# EAGLE design indor (EAGLE 9.5.2)

## Sheet 1 of 2
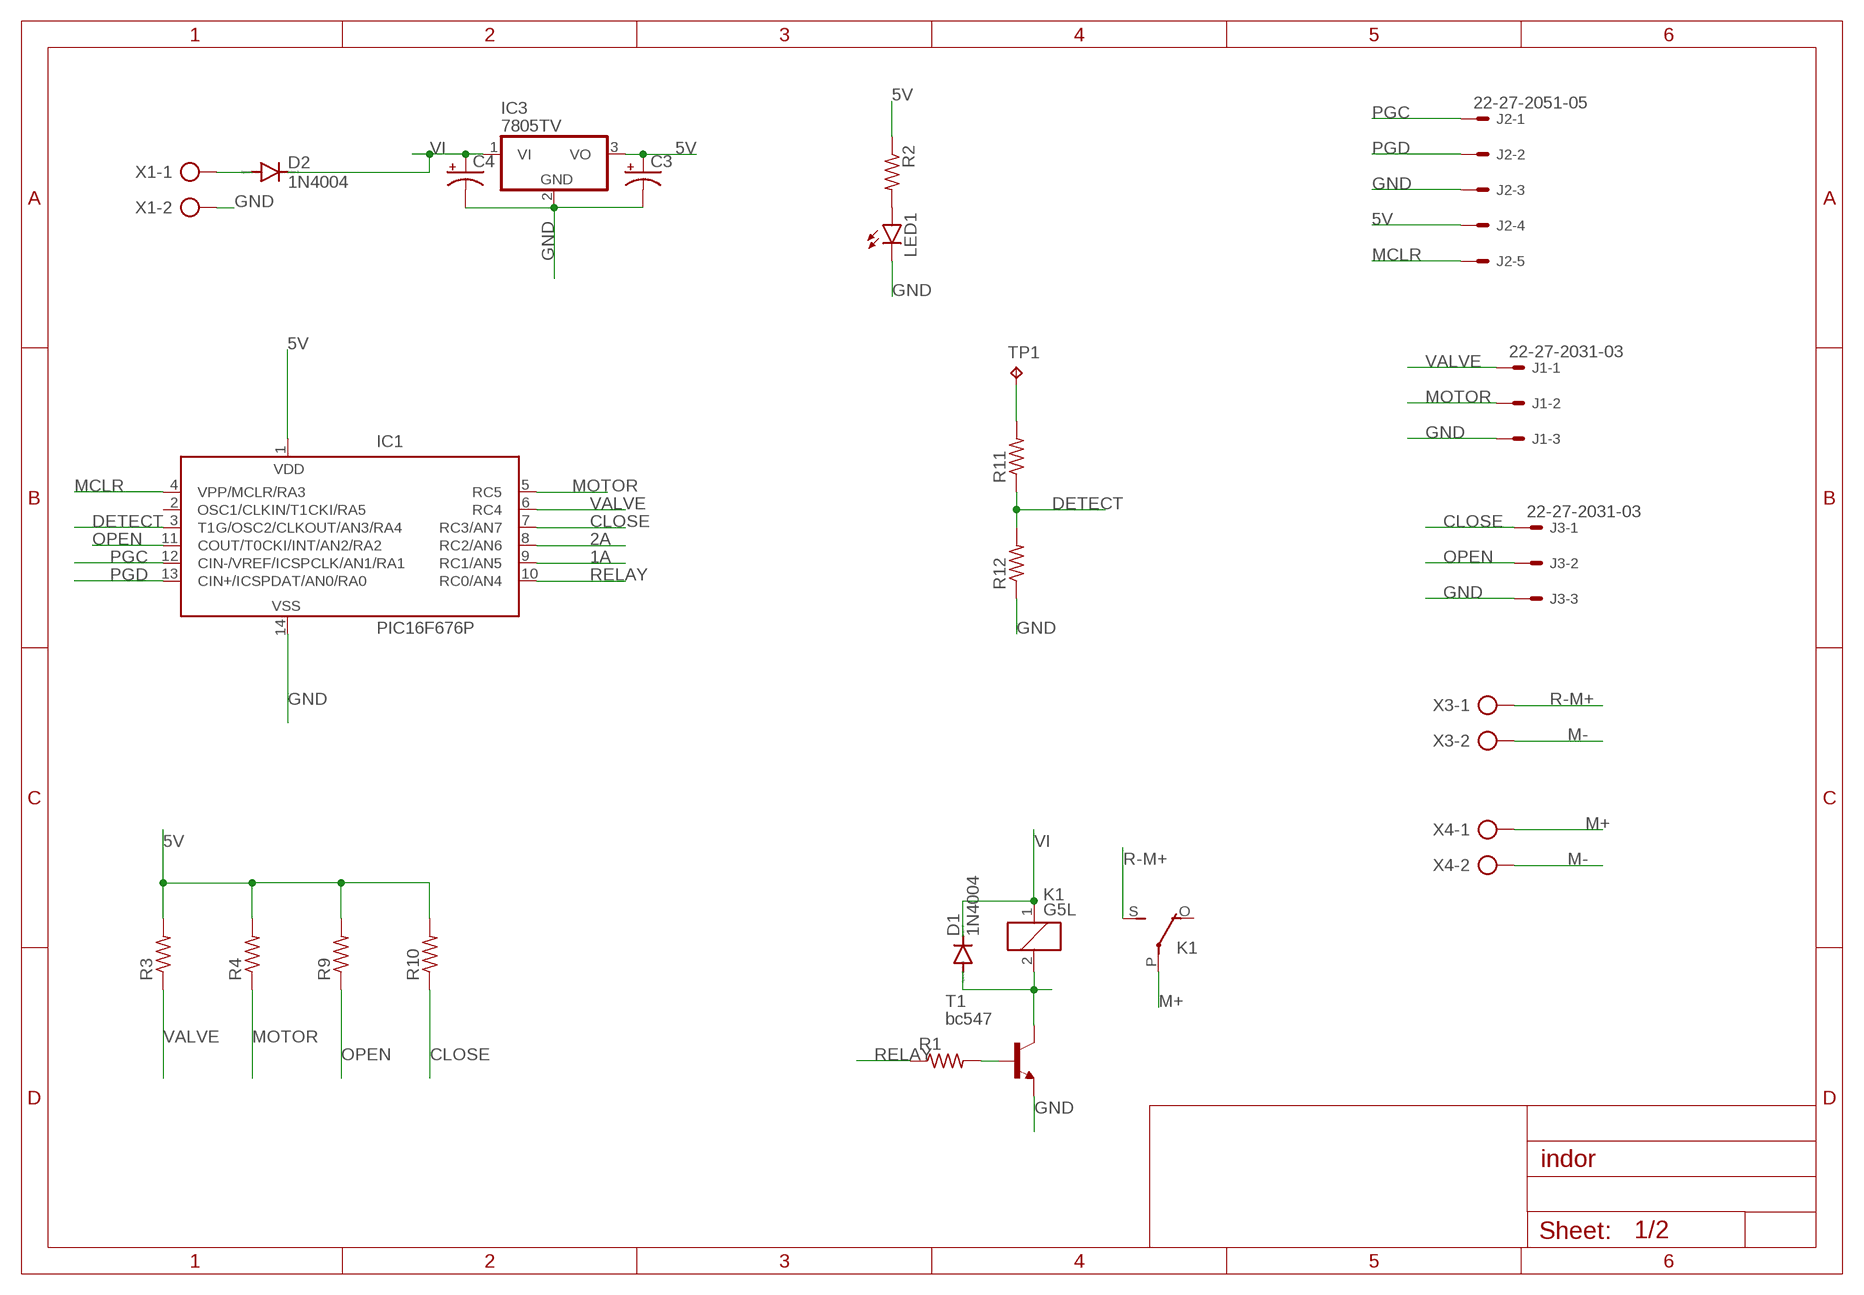
[diagram p0: schematic, sheet 1]

### Parts
C3  CPOL-USE3.5-10  [E3,5-10]
C4  CPOL-USE3.5-10  [E3,5-10]
D1  1N4004  [DO41-10]
D2  1N4004  [DO41-10]
IC1  PIC16F676P  [DIL14]
IC3  7805TV  [TO220V]
J1  22-27-2031-03  [6410-03]
J2  22-27-2051-05  [6410-05]
J3  22-27-2031-03  [6410-03]
K1  G5L  [G5LE]
LED1  LED5MM  [LED5MM]
R1  R-US_0207/10  [0207/10]
R2  R-US_0207/10  [0207/10]
R3  R-US_0207/10  [0207/10]
R4  R-US_0207/10  [0207/10]
R9  R-US_0207/10  [0207/10]
R10  R-US_0207/10  [0207/10]
R11  R-US_0207/10  [0207/10]
R12  R-US_0207/10  [0207/10]
T1  bc547  BC547-NPN-TO92-CBE  [TO92-CBE]
TP1  TPPAD1-13Y  [P1-13Y]
X1  AK500/2  [AK500/2]
X3  AK500/2  [AK500/2]
X4  AK500/2  [AK500/2]

### Nets
1A: IC1.9(RC1/AN5) ; also sheet 2
2A: IC1.8(RC2/AN6) ; also sheet 2
5V: C3.+ IC1.1(VDD) IC3.3(VO) J2.4 R2.1 R3.2 R4.2 R9.2 R10.2
CLOSE: IC1.7(RC3/AN7) J3.1 R10.1
DETECT: IC1.3(T1G/OSC2/CLKOUT/AN3/RA4) R11.1 R12.2
GND: C3.- C4.- IC1.14(VSS) IC3.2(GND) J1.3 J2.3 J3.3 LED1.K(C) R12.1 T1.E X1.2 ; also sheet 2
M+: K1.P(2:P) X4.1
M-: X3.2 X4.2
MCLR: IC1.4(VPP/MCLR/RA3) J2.5
MOTOR: IC1.5(RC5) J1.2 R4.1
N$1: LED1.A R2.2
N$2: D2.A X1.1
N$3: R11.2 TP1.TP
N$6: R1.2 T1.B
N$7: D1.A K1.2 T1.C
OPEN: IC1.11(COUT/T0CKI/INT/AN2/RA2) J3.2 R9.1
PGC: IC1.12(CIN-/VREF/ICSPCLK/AN1/RA1) J2.1
PGD: IC1.13(CIN+/ICSPDAT/AN0/RA0) J2.2
R-M+: K1.S(2:S) X3.1
RELAY: IC1.10(RC0/AN4) R1.1
VALVE: IC1.6(RC4) J1.1 R3.1
VI: C4.+ D1.C D2.C IC3.1(VI) K1.1 ; also sheet 2
Unconnected: IC1.2(OSC1/CLKIN/T1CKI/RA5) K1.O(2:O)

## Sheet 2 of 2
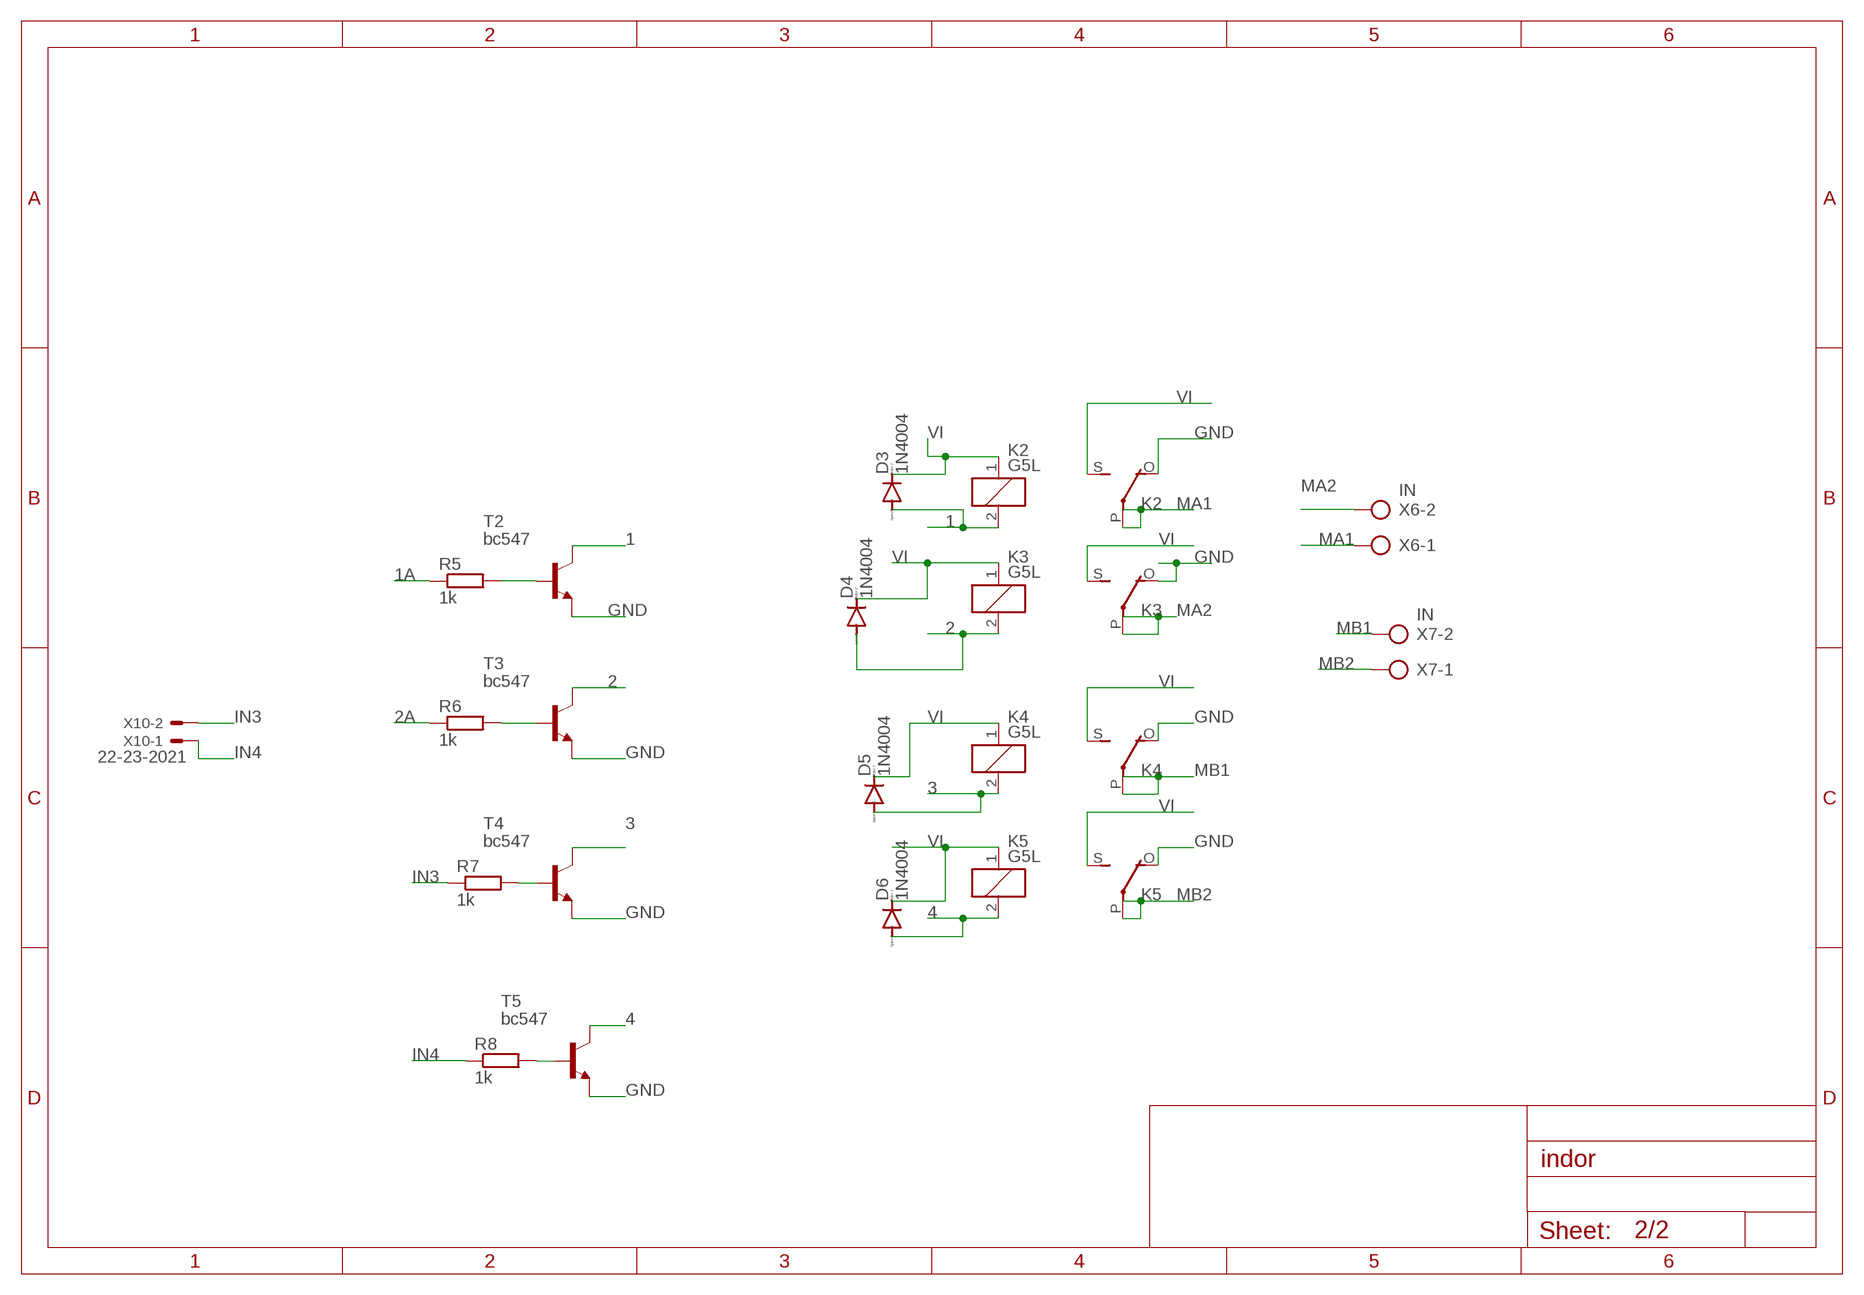
[diagram p1: schematic, sheet 2]

### Parts
D3  1N4004  [DO41-10]
D4  1N4004  [DO41-10]
D5  1N4004  [DO41-10]
D6  1N4004  [DO41-10]
K2  G5L  [G5LE]
K3  G5L  [G5LE]
K4  G5L  [G5LE]
K5  G5L  [G5LE]
R5  1k  R-EU_0207/10  [0207/10]
R6  1k  R-EU_0207/10  [0207/10]
R7  1k  R-EU_0207/10  [0207/10]
R8  1k  R-EU_0207/10  [0207/10]
T2  bc547  BC547-NPN-TO92-CBE  [TO92-CBE]
T3  bc547  BC547-NPN-TO92-CBE  [TO92-CBE]
T4  bc547  BC547-NPN-TO92-CBE  [TO92-CBE]
T5  bc547  BC547-NPN-TO92-CBE  [TO92-CBE]
X6  IN  AK500/2  [AK500/2]
X7  IN  AK500/2  [AK500/2]
X10  22-23-2021  [22-23-2021]

### Nets
1: D3.A K2.2 T2.C
1A: R5.1 ; also sheet 1
2: D4.A K3.2 T3.C
2A: R6.1 ; also sheet 1
3: D5.A K4.2 T4.C
4: D6.A K5.2 T5.C
GND: K2.O(2:O) K3.O(2:O) K4.O(2:O) K5.O(2:O) T2.E T3.E T4.E T5.E ; also sheet 1
IN3: R7.1 X10.2
IN4: R8.1 X10.1
MA1: K2.P(2:P) X6.1
MA2: K3.P(2:P) X6.2
MB1: K4.P(2:P) X7.2
MB2: K5.P(2:P) X7.1
N$9: R8.2 T5.B
N$10: R7.2 T4.B
N$11: R6.2 T3.B
N$12: R5.2 T2.B
VI: D3.C D4.C D5.C D6.C K2.1 K2.S(2:S) K3.1 K3.S(2:S) K4.1 K4.S(2:S) K5.1 K5.S(2:S) ; also sheet 1

## Library data of the parts
C3 C4 = rcl:CPOL-US: POLARIZED CAPACITOR, American symbol; SPICEPREFIX: C
D1-D6 = diode:1N4004: DIODE general purpose rectifier, 1 A
IC1 = microchip:PIC16F676: 14-Pin, Flash-Based 8-Bit CMOS Microcontroller High Performance RISC CPU: * Only 35 instructions to learn - All single-cycle instructions except branches * Operating speed: - DC - 20 MHz oscillator/clock input - DC - 200 ns instruction cycle * Internal and external oscillator options - Precision Internal 4 MHz oscillator factory calibrated to ±1% - External Oscillator support for crystals and resonators - 5?s wake-up from SLEEP, 3.0V, typical * Power saving SLEEP mode * Wide operating voltage range - 2.0V to 5.5V * Industrial and Extended temperature range * Low power Power-on Reset (POR) * Power-up Timer (PWRT) and Oscillator Start-up Timer (OST) * Brown-out Detect (BOD) * Watchdog Timer (WDT) with independent oscillator for reliable operation * Multiplexed MCLR/Input-pin * Interrupt-on-pin change * Individual programmable weak pull-ups * Programmable code protection * High Endurance FLASH/EEPROM Cell - 100,000 write FLASH endurance - 1,000,000 write EEPROM endurance - FLASH/Data EEPROM Retention: > 40 years * Standby Current: - 1 nA @ 2.0V, typical * Operating Current: - 8.5?A @ 32 kHz, 2.0V, typical - 100?A @ 1 MHz, 2.0V, typical * Watchdog Timer Current - 300 nA @ 2.0V, typical * Timer1 oscillator current: - 4?A @ 32 kHz, 2.0V, typical * 12 I/O pins with individual direction control * High current sink/source for direct LED drive * Analog-to-Digital Converter module (PIC16F676): - 10-bit resolution - Programmable 8-channel input - Voltage reference input * In-Circuit Serial ProgrammingTM (ICSPTM) via two pins Source: http://ww1.microchip.com/downloads/en/DeviceDoc/40039E.pdf; MF: MICROCHIP; MPN: PIC16F676-I/P; OC_FARNELL: 9760512; OC_NEWARK: 54K2829
IC3 = linear:78*: Positive VOLTAGE REGULATOR Source: http://cache.national.com/ds/LM/LM78L05.pdf http://www.fairchildsemi.com/ds/LM/LM7805.pdf
J1 J3 = con-molex:22-?-03: CONNECTOR wire to board 2.54 mm (.1 inch) pitch header; MF: MOLEX; OC_FARNELL: unknown; OC_NEWARK: unknown
J2 = con-molex:22-?-05: CONNECTOR wire to board 2.54 mm (.1 inch) pitch header; MF: MOLEX; OC_FARNELL: unknown; OC_NEWARK: unknown
K1-K5 = relay:G5L: RELAY 1 x switch, 10 A/120 V AC, 8 A/30 V ADC, Omron; OC_FARNELL: unknown; OC_NEWARK: unknown
LED1 = led:LED: LED OSRAM: - CHIPLED LG R971, LG N971, LY N971, LG Q971, LY Q971, LO R971, LY R971 LH N974, LH R974 LS Q976, LO Q976, LY Q976 LO Q996 - Hyper CHIPLED LW Q18S LB Q993, LB Q99A, LB R99A - SideLED LS A670, LO A670, LY A670, LG A670, LP A670 LB A673, LV A673, LT A673, LW A673 LH A674 LY A675 LS A676, LA A676, LO A676, LY A676, LW A676 LS A679, LY A679, LG A679 - Hyper Micro SIDELED® LS Y876, LA Y876, LO Y876, LY Y876 LT Y87S - SmartLED LW L88C, LW L88S LB L89C, LB L89S, LG L890 LS L89K, LO L89K, LY L89K LS L896, LA L896, LO L896, LY L896 - TOPLED LS T670, LO T670, LY T670, LG T670, LP T670 LSG T670, LSP T670, LSY T670, LOP T670, LYG T670 LG T671, LOG T671, LSG T671 LB T673, LV T673, LT T673, LW T673 LH T674 LS T676, LA T676, LO T676, LY T676, LB T676, LH T676, LSB T676, LW T676 LB T67C, LV T67C, LT T67C, LS T67K, LO T67K, LY T67K, LW E67C LS E67B, LA E67B, LO E67B, LY E67B, LB E67C, LV E67C, LT E67C LW T67C LS T679, LY T679, LG T679 LS T770, LO T770, LY T770, LG T770, LP T770 LB T773, LV T773, LT T773, LW T773 LH T774 LS E675, LA E675, LY E675, LS T675 LS T776, LA T776, LO T776, LY T776, LB T776 LHGB T686 LT T68C, LB T68C - Hyper Mini TOPLED® LB M676 - Mini TOPLED Santana® LG M470 LS M47K, LO M47K, LY M47K Source: http://www.osram.convergy.de LUXEON: - LUMILED® LXK2-PW12-R00, LXK2-PW12-S00, LXK2-PW14-U00, LXK2-PW14-V00 LXK2-PM12-R00, LXK2-PM12-S00, LXK2-PM14-U00 LXK2-PE12-Q00, LXK2-PE12-R00, LXK2-PE12-S00, LXK2-PE14-T00, LXK2-PE14-U00 LXK2-PB12-K00, LXK2-PB12-L00, LXK2-PB12-M00, LXK2-PB14-N00, LXK2-PB14-P00, LXK2-PB14-Q00 LXK2-PR12-L00, LXK2-PR12-M00, LXK2-PR14-Q00, LXK2-PR14-R00 LXK2-PD12-Q00, LXK2-PD12-R00, LXK2-PD12-S00 LXK2-PH12-R00, LXK2-PH12-S00 LXK2-PL12-P00, LXK2-PL12-Q00, LXK2-PL12-R00 Source: www.luxeon.com KINGBRIGHT: KA-3528ASYC Source: www.kingbright.com
R1-R4 R9-R12 = rcl:R-US_: RESISTOR, American symbol; SPICEPREFIX: R
R5-R8 = rcl:R-EU_: RESISTOR, European symbol; SPICEPREFIX: R
T1-T5 = transistor:*-NPN-: NPN Transistror BF959 corrected 2008.03.06
TP1 = testpad:TP: Test pad
X1 X3 X4 X6 X7 = con-ptr500:AK500/2: CONNECTOR; OC_FARNELL: unknown; OC_NEWARK: unknown
X10 = con-molex:22-23-2021: .100" (2.54mm) Center Header - 2 Pin; MF: MOLEX; MPN: 22-23-2021; OC_FARNELL: 1462926; OC_NEWARK: 25C3832

## Net classes
0 default: width 1 mm, clearance 0.7 mm

## Board
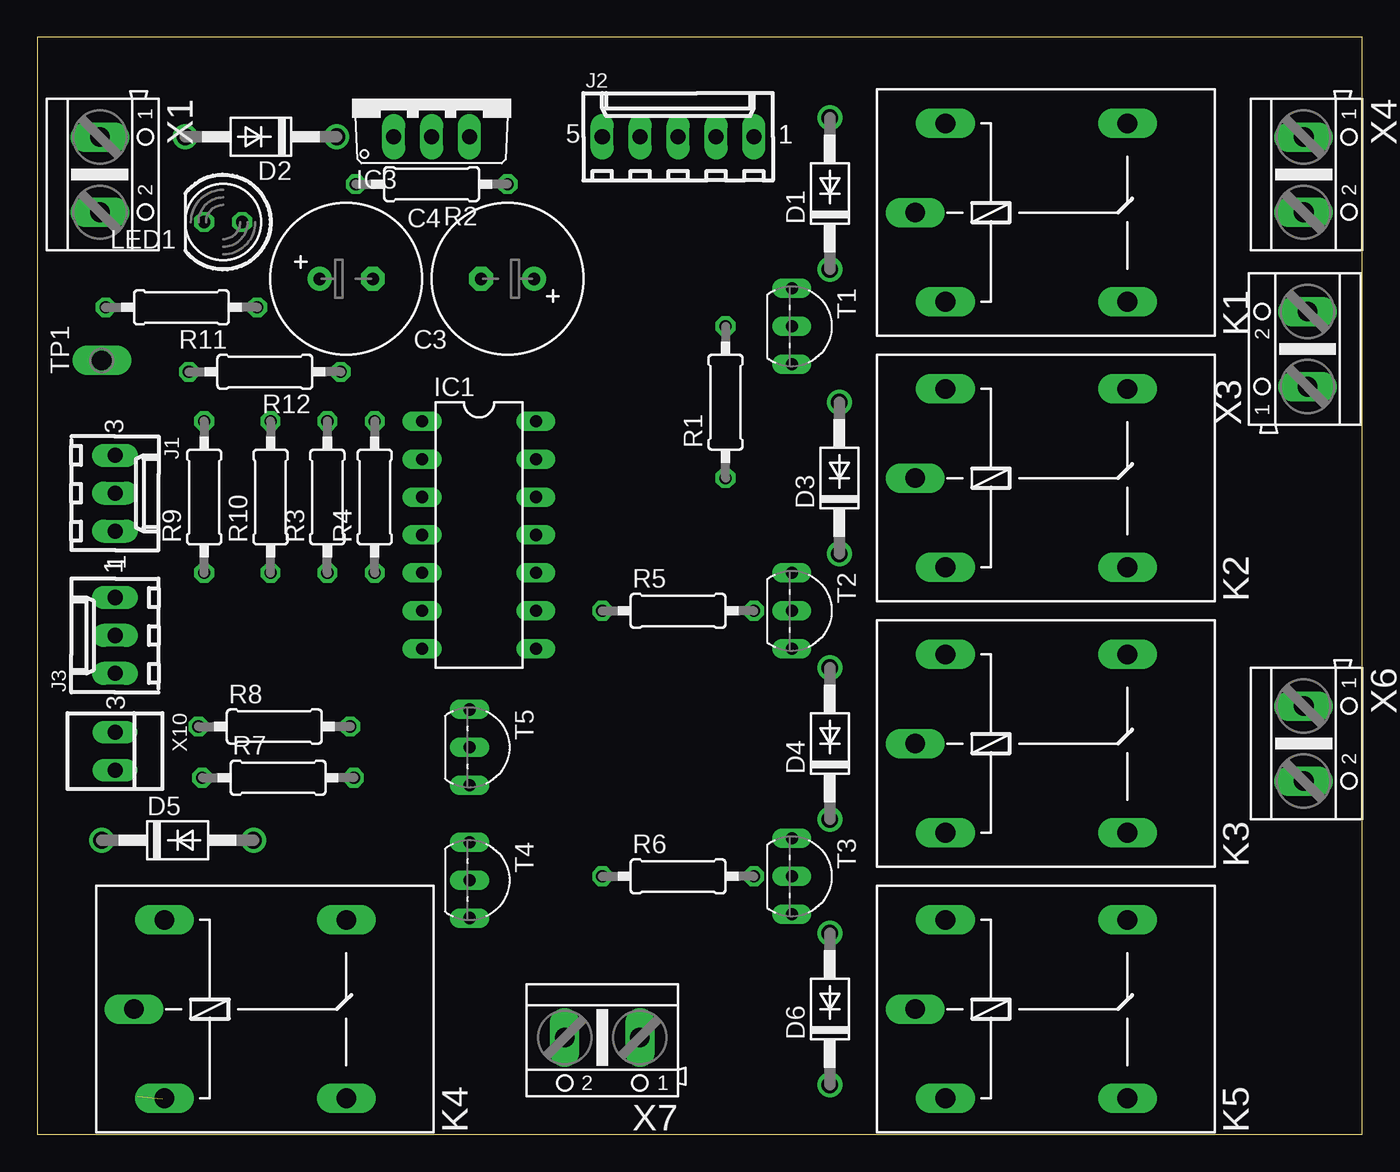
[diagram p2: board, top side]
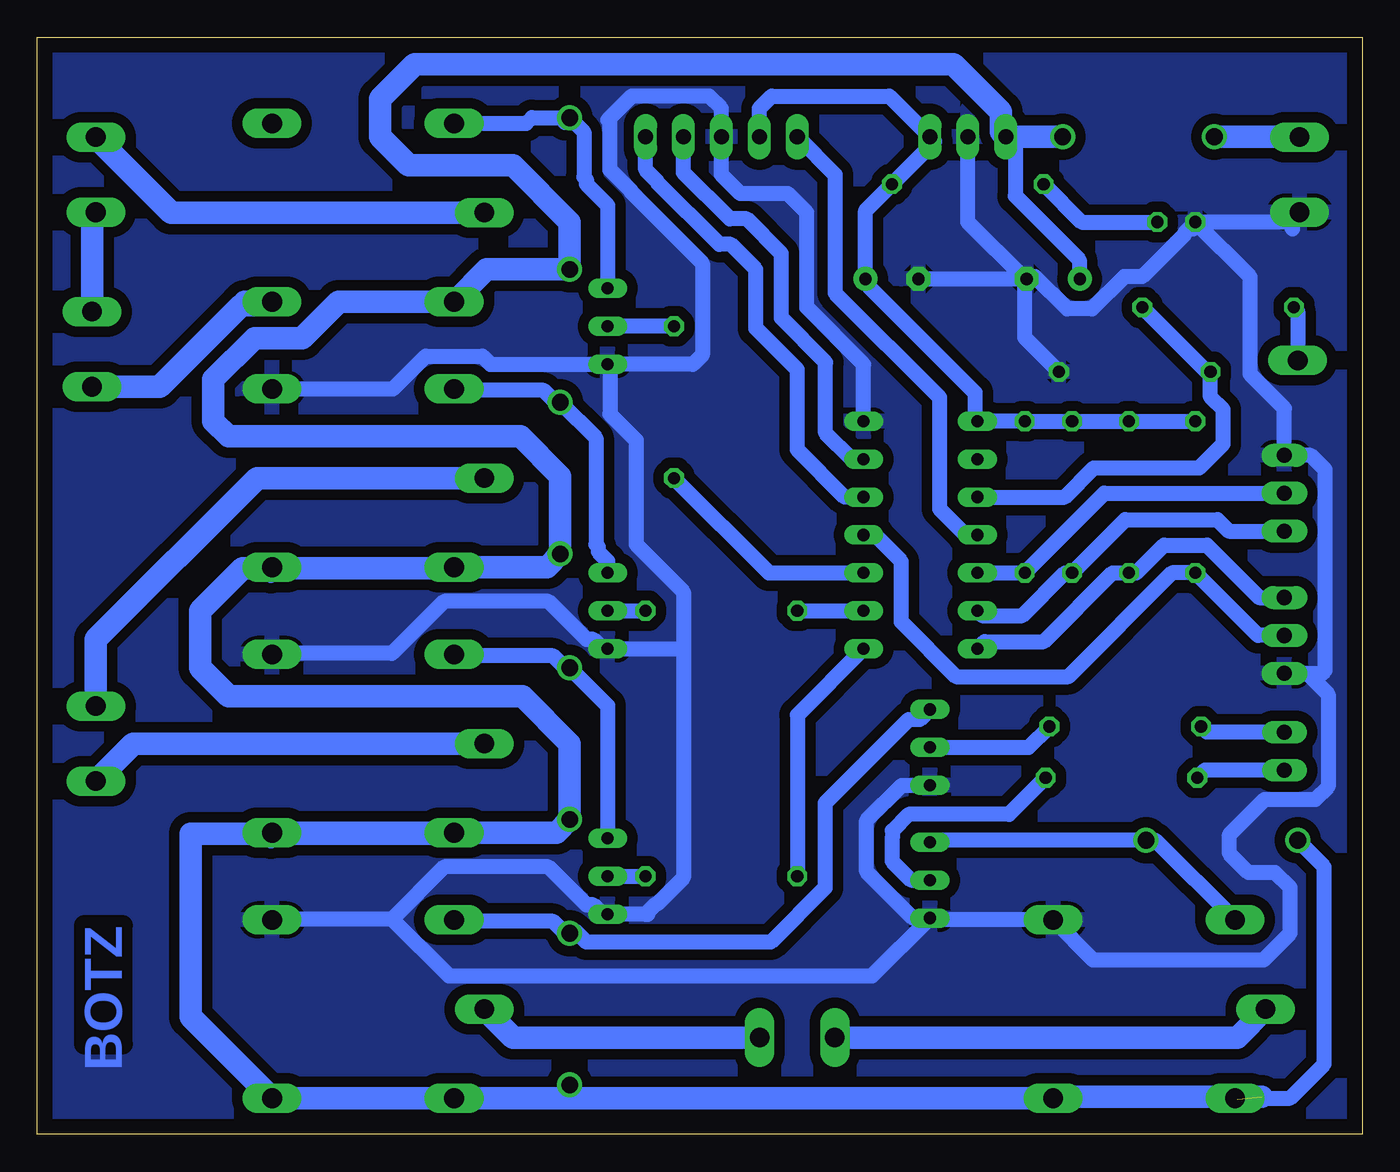
[diagram p3: board, bottom side, seen from below]

Size 88.75 x 73.46 mm. Coordinates in mm from the lower left corner, seen from the top.
Outline: 0,0 88.75,0 88.75,73.46 0,73.46 0,0
Copper layers (1*16): Top 0.035mm / dielectric 1.5mm / Bottom 0.035mm
Design rules "default *": minimum track width 6mil, minimum drill 0.35mm, track to track 0.7mm, track to pad 0.7mm, pad to pad 6mil, via to via 6mil, smd to smd 6mil, copper to edge 40mil, drill to drill 6mil, minimum pad ring 10mil, minimum via ring 8mil, stop-mask expansion 4mil, vias tented up to drill 0mil, thermal gap 10mil

### Footprints (pad centres in the part's own frame; a part is rotated, then mirrored left to right if it is on the bottom)
E3,5-10 = drill 0.813 pad 1.6: + -1.778,0 | drill 0.813 pad 1.6 octagon: - 1.778,0
DO41-10 = drill 1.118: A 5.08,0; C -5.08,0
DIL14 = drill 0.813 long: 1 -7.62,-3.81; 2 -5.08,-3.81; 3 -2.54,-3.81; 4 0,-3.81; 5 2.54,-3.81; 6 5.08,-3.81; 7 7.62,-3.81; 8 7.62,3.81; 9 5.08,3.81; 10 2.54,3.81; 11 0,3.81; 12 -2.54,3.81; 13 -5.08,3.81; 14 -7.62,3.81
TO220V = drill 1.016 long: 1 -2.54,-2.54; 2 0,-2.54; 3 2.54,-2.54
6410-03 = drill 1.016 long: 1 2.54,0; 2 0,0; 3 -2.54,0
6410-05 = drill 1.016 long: 1 5.08,0; 2 2.54,0; 3 0,0; 4 -2.54,0; 5 -5.08,0
G5LE = drill 1.321 long: 1 -7.493,-5.969; 2 -7.493,5.969; O 4.699,5.969; P -9.525,0; S 4.699,-5.969
LED5MM = drill 0.813 octagon: A -1.27,0; K 1.27,0
0207/10 = drill 0.813 octagon: 1 -5.08,0; 2 5.08,0
TO92-CBE = drill 0.813 long: B 0,0; C -2.54,0; E 2.54,0
P1-13Y = drill 1.321 pad 1.905 long: TP 0,0
AK500/2 = drill 1.321 long: 1 -2.515,0; 2 2.515,0
22-23-2021 = drill 1 long: 1 -1.27,0; 2 1.27,0

### Placement (x,y rotation side)
C3  31.5,57.28 180 top
C4  20.7,57.28 0 top
D1  53.09,62.99 90 top
D2  14.99,66.8 180 top
D3  53.72,43.94 90 top
D4  53.09,26.16 90 top
D5  9.4,19.69 0 top
D6  53.09,8.38 90 top
IC1  29.59,40.13 270 top
IC3  26.42,69.34 0 top
J1  5.21,42.93 270 top
J2  42.93,66.8 0 top
J3  5.21,33.4 90 top
K1  68.33,61.72 0 top
K2  68.33,43.94 0 top
K3  68.33,26.16 0 top
K4  16,8.38 0 top
K5  68.33,8.38 0 top
LED1  12.45,61.09 180 top
R1  46.1,49.02 90 top
R2  26.42,63.63 180 top
R3  19.43,42.67 90 top
R4  22.61,42.67 90 top
R5  42.93,35.05 0 top
R6  42.93,17.27 0 top
R7  16.13,23.88 0 top
R8  15.88,27.3 0 top
R9  11.18,42.67 90 top
R10  15.62,42.67 90 top
R11  9.65,55.37 180 top
R12  15.24,51.05 180 top
T1  50.55,54.1 270 top
T2  50.55,35.05 270 top
T3  50.55,17.27 270 top
T4  28.96,17.02 270 top
T5  28.96,25.91 270 top
TP1  4.32,51.82 90 top
X1  4.19,64.26 270 top
X3  85.09,52.58 90 top
X4  84.84,64.26 270 top
X6  84.84,26.16 270 top
X7  37.85,6.48 180 top
X10  5.21,25.65 270 top

### Tracks (layer width: path | path; a pad name or v marks a point on that pad's centre or on a via)
1
  Bottom 1: T2.C 50.55,38.39 51.18,39.02 51.18,39.34 51.34,39.5 51.34,46.64 D3.A 54.2,49.18 54.83,49.82 60.71,49.82 K2.2
1A
  Bottom 1: R5.1 IC1.9
2
  Bottom 1: T3.C 50.55,28.7 D4.A 53.56,31.4 54.2,32.04 60.71,32.04 K3.2
2A
  Bottom 1: R6.1 37.85,28.07 IC1.8
3
  Bottom 1: K4.2 13.84,19.69 D5.A 28.83,19.69 T4.C
4
  Bottom 1: 53.56,13.62 54.2,14.26 60.71,14.26 K5.2 | 53.56,13.62 D6.A 52.57,13.46 | 52.57,13.46 51.98,12.87 39.62,12.87 35.99,16.5 35.99,22.17 30.39,27.77 29.64,27.77 T5.C | 52.57,13.46 52.73,13.62 53.56,13.62
5V
  Bottom 1: R9.2 R10.2 R3.2 R4.2 IC1.1 25.94,48.23 25.94,49.66 33.08,56.8 C3.+ | 40.39,67.91 J2.4 40.39,68.71 39.57,69.53 31.68,69.53 IC3.3 28.64,66.48 R2.1 33.27,61.85 C3.+ | 33.24,57.28 C3.+
CLOSE
  Bottom 1: IC1.7 25.3,32.99 21.34,32.99 16.73,37.59 R10.1 15.15,37.59 13.28,39.45 10.41,39.45 6.89,35.94 J3.1
DETECT
  Bottom 1: R11.1 10.41,51.05 R12.2 10.16,49.37 9.32,48.52 9.32,46.23 10.92,44.63 17.98,44.63 19.93,42.67 IC1.3
GND
  Bottom 1: 4.83,61.09 LED1.K | 4.83,61.09 4.19,61.72 X1.2 | 4.67,60.61 4.83,61.09 | IC3.2 26.42,61.09 22.61,57.28 | 22.61,57.28 C4.- 22.13,57.44 21.91,57.44 19.75,55.28 18.1,55.28 15.94,57.44 14.74,57.44 11.86,60.32 11.86,60.41 LED1.K | 29.59,57.28 C3.- 22.61,57.28 | 11.34,60.61 LED1.K | 34.2,47.75 IC1.14 33.4,51.56 37.21,55.37 37.21,61.72 38.48,62.99 41.66,62.99 42.93,64.26 J2.3 42.93,68.71 43.74,69.53 48.93,69.53 50.55,67.91 50.39,67.75 50.39,64.58 48.96,63.15 48.96,63.08 44.2,58.32 44.2,52.2 44.83,51.56 T1.E | T1.E 58.4,51.56 58.93,52.1 62.73,52.1 64.92,49.91 K2.O | 47.85,14.73 48.01,14.73 | 48.01,14.73 T3.E 51.02,14.89 51.5,15.37 51.98,15.37 54.52,17.91 61.5,17.91 64.99,14.41 | 64.99,14.41 72.93,14.41 K5.O | K3.O 72.93,32.19 64.99,32.19 61.5,35.69 54.52,35.69 51.98,33.15 51.5,33.15 51.02,32.67 T2.E 45.47,32.51 | T1.E 50.39,51.09 50.39,48.23 48.64,46.48 48.64,39.5 45.47,36.32 45.47,32.51 | 64.99,14.41 61.18,10.6 32.83,10.6 T4.E | 48.01,14.73 47.33,15.41 47.24,15.41 45.47,17.18 45.47,32.51 | T4.E 28.83,14.35 K4.O 18.03,11.68 6.6,11.68 4.83,13.46 4.83,16.51 5.84,17.53 7.62,17.53 8.89,18.8 8.89,20.07 6.53,22.43 3.14,22.43 2.29,23.28 2.29,29.46 3.68,30.86 J3.3 2.67,30.86 2.48,31.05 2.48,44.5 3.45,45.47 J1.3 5.21,48.62 7.5,50.91 7.5,57.41 LED1.K | T5.E 30.84,23.37 33.2,21.01 33.2,17.58 30.09,14.48 T4.E | R12.1 22.61,53.34 22.61,57.28
  pour Bottom (isolate 0.61): 0.25,73.41 88.65,73.41 88.65,0 0.51,0 0.25,0.25 0.25,73.15 0.51,73.41 0.76,73.41
IN3
  Bottom 1: X10.2 10.54,24.38 R7.1
IN4
  Bottom 1: X10.1 10.41,26.92 R8.1
M+
  Bottom 1.5: X4.1 79.78,61.72 K1.P
M-
  Bottom 1: 84.84,61.88 X4.2
  Bottom 1.5: 84.36,61.88 84.84,61.88 85.09,61.63 X3.2
MA1
  Bottom 1: K2.P 58.96,43.94
  Bottom 1.5: K2.P 74.04,43.94 84.84,33.15 X6.1
MA2
  Bottom 1.5: X6.2 82.32,26.16 K3.P
MB1
  Bottom 1.5: K4.P 8.38,6.48 X7.2
MB2
  Bottom 1.5: K5.P 56.9,6.48 X7.1
MCLR
  Bottom 1: IC1.4 26.57,40.13 28.32,41.88 28.32,49.34 35.31,56.33 35.31,64.26 J2.5
MOTOR
  Bottom 1: IC1.5 R4.1 17.27,42.93 J1.2
N$1
  Bottom 1: LED1.A 18.8,61.09 R2.2
N$2
  Bottom 1: 4.19,66.8 X1.1
  Bottom 1.5: D2.A 4.19,66.8
N$3
  Bottom 1: R11.2 4.32,55.12 TP1.TP
N$6
  Bottom 1: R1.2 T1.B
N$7
  Bottom 1: T1.C 50.55,62.2 51.98,63.63 51.98,63.94 52.13,64.1 52.13,67.12 D1.A | 53.4,67.75 D1.A | K1.2 56.01,67.69 55.63,68.07 D1.A
N$9
  Bottom 1: T5.B 22.35,25.91 R8.2
N$10
  Bottom 1: R7.2 23.67,21.42 30.39,21.42 31.48,20.33 31.48,19.83 31.5,19.81 31.5,18.29 30.23,17.02 T4.B
N$11
  Bottom 1: T3.B R6.2
N$12
  Bottom 1: T2.B R5.2
OPEN
  Bottom 1: IC1.11 32.65,40.13 30.88,38.36 30.88,34.32 27.21,30.65 19.68,30.65 12.74,37.59 R9.1 6.99,33.4 J3.2
PGC
  Bottom 1: 34.2,42.67 IC1.12 34.67,42.67 37.85,45.85 37.85,51.2 40.61,53.96 40.61,57.91 42.29,59.59 43.06,59.59 47.26,63.79 47.26,63.86 48.01,64.6 J2.1
PGD
  Bottom 1: IC1.13 34.2,45.21 35.94,46.96 35.94,51.7 38.91,54.67 38.91,58.98 41.23,61.29 42.36,61.29 45.47,64.4 J2.2
R-M+
  Bottom 1.5: 74.87,55.75 K1.S 73.27,55.51 75.11,55.51 80.56,50.06 X3.1
RELAY
  Bottom 1: 32.61,37.59 IC1.10 39.75,37.59 R1.1
VALVE
  Bottom 1: IC1.6 25.46,34.73 22.77,34.73 19.91,37.59 R3.1 15.87,41.15 9.7,41.15 8.93,40.39 J1.1
VI  (1 unrouted)
  Bottom 1: 60.71,55.85 K1.1 | C4.+ 18.96,57.28 18.96,58.55 23.24,62.83 23.24,66.33 IC3.1 | 8.38,2.35 K4.1 | 9.02,2.51 K4.1 | 60.71,2.51 K5.1 | 72.93,2.35 K5.S 73.25,2.83 | 60.71,38.07 K2.1 61.34,37.91 | 72.93,37.91 K2.S 73.09,37.43 | 60.71,20.29 K3.1 61.34,20.13 | 72.93,20.13 K3.S 73.09,19.65 | 21.08,2.19 K4.S | K4.1 4.83,2.41 2.54,4.7 2.54,17.91 D5.C
  Bottom 1.5: 6.73,2.51 20.61,2.51 K4.S 53.09,2.41 | 61.34,37.91 72.93,37.91 74.99,37.91 77.85,35.05 77.85,31.24 75.95,29.34 56.26,29.34 53.09,26.16 D4.C 53.98,20.19 K3.1 | 61.34,20.13 72.93,20.13 78.49,20.13 78.49,7.87 K5.S 60.8,2.41 60.71,2.51 | 60.71,55.85 58.64,57.91 D1.C 53.09,61.09 56.9,64.9 63.88,64.9 65.79,66.8 65.79,69.34 63.48,71.64 27.37,71.64 24.2,68.48 24.2,67.13 IC3.1 D2.C | K1.1 68.58,55.75 71.02,53.31 74.2,53.31 76.96,50.55 76.96,47.75 75.95,46.74 56.39,46.74 53.72,44.07 D3.C 54.61,37.97 K2.1 | K3.S 60.8,20.19 60.71,20.29 | K5.1 53.09,2.41 | D6.C 53.09,2.41

### Text on the board
Bottom: BOTZ